# Altium schematic sheet LED_Driver_QBHP686.SchDoc: STB Light Board - 740nm
size A3; Author: mayerph; DrawnBy: mayerph; Organization: PBL; Revision: A; SheetNumber: 2; SheetTotal: 20
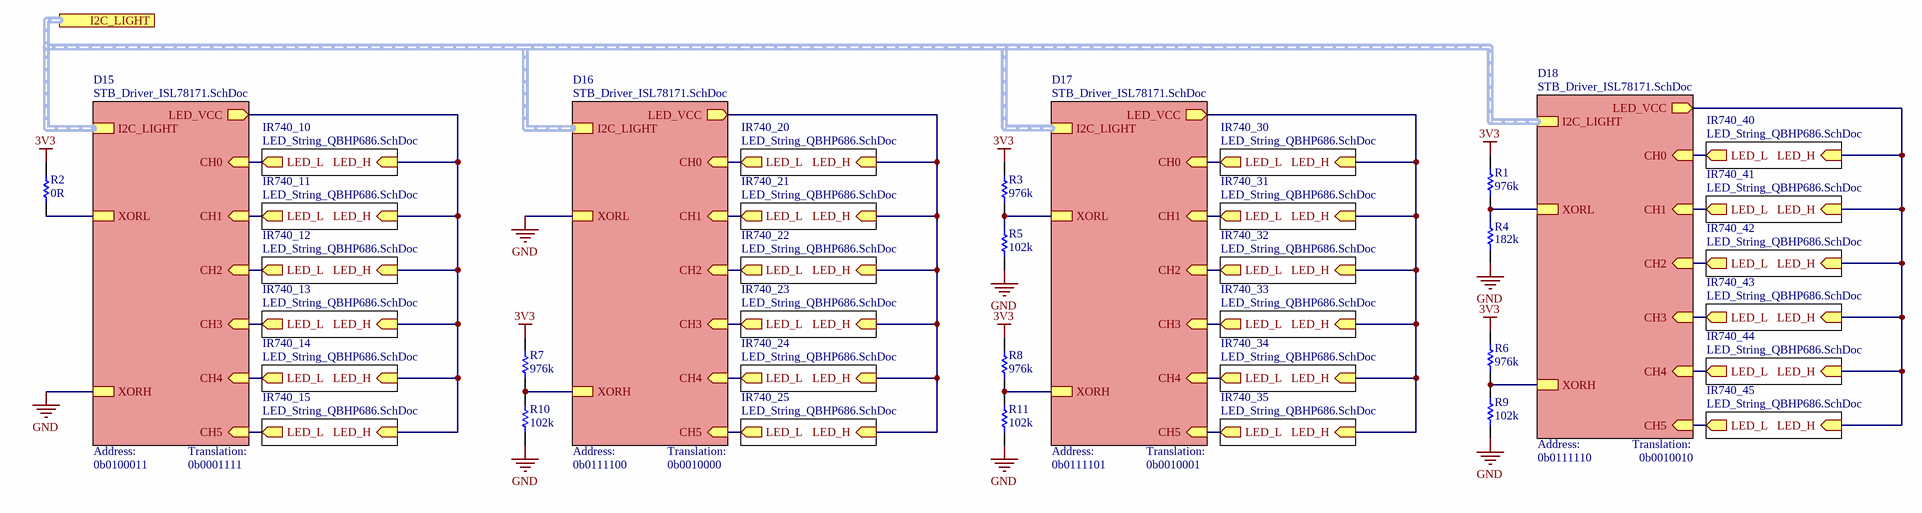
[diagram p0: LED_Driver_QBHP686.SchDoc]

## Parts
R1  976k  [RESC1005X40X25LL05T05]
R2  0R  [RESC1005X40X25LL05T10]
R3  976k  [RESC1005X40X25LL05T05]
R4  182k  [RESC1005X40X25LL05T05]
R5  102k  [RESC1005X40X25LL05T05]
R6  976k  [RESC1005X40X25LL05T05]
R7  976k  [RESC1005X40X25LL05T05]
R8  976k  [RESC1005X40X25LL05T05]
R9  102k  [RESC1005X40X25LL05T05]
R10  102k  [RESC1005X40X25LL05T05]
R11  102k  [RESC1005X40X25LL05T05]

## Sub-sheets
D15 = STB_Driver_ISL78171.SchDoc: CH0 (in), XORL, XORH, LED_VCC (out), CH1 (in), CH2 (in), CH3 (in), CH4 (in), CH5 (in), I2C_LIGHT (harness I2C_LIGHT)
D16 = STB_Driver_ISL78171.SchDoc: CH0 (in), XORL, XORH, LED_VCC (out), CH1 (in), CH2 (in), CH3 (in), CH4 (in), CH5 (in), I2C_LIGHT (harness I2C_LIGHT)
D17 = STB_Driver_ISL78171.SchDoc: CH0 (in), XORL, XORH, LED_VCC (out), CH1 (in), CH2 (in), CH3 (in), CH4 (in), CH5 (in), I2C_LIGHT (harness I2C_LIGHT)
D18 = STB_Driver_ISL78171.SchDoc: CH0 (in), XORL, XORH, LED_VCC (out), CH1 (in), CH2 (in), CH3 (in), CH4 (in), CH5 (in), I2C_LIGHT (harness I2C_LIGHT)
IR740_10 = LED_String_QBHP686.SchDoc: LED_H (in), LED_L (out)
IR740_11 = LED_String_QBHP686.SchDoc: LED_H (in), LED_L (out)
IR740_12 = LED_String_QBHP686.SchDoc: LED_H (in), LED_L (out)
IR740_13 = LED_String_QBHP686.SchDoc: LED_H (in), LED_L (out)
IR740_14 = LED_String_QBHP686.SchDoc: LED_H (in), LED_L (out)
IR740_15 = LED_String_QBHP686.SchDoc: LED_H (in), LED_L (out)
IR740_20 = LED_String_QBHP686.SchDoc: LED_H (in), LED_L (out)
IR740_21 = LED_String_QBHP686.SchDoc: LED_H (in), LED_L (out)
IR740_22 = LED_String_QBHP686.SchDoc: LED_H (in), LED_L (out)
IR740_23 = LED_String_QBHP686.SchDoc: LED_H (in), LED_L (out)
IR740_24 = LED_String_QBHP686.SchDoc: LED_H (in), LED_L (out)
IR740_25 = LED_String_QBHP686.SchDoc: LED_H (in), LED_L (out)
IR740_30 = LED_String_QBHP686.SchDoc: LED_H (in), LED_L (out)
IR740_31 = LED_String_QBHP686.SchDoc: LED_H (in), LED_L (out)
IR740_32 = LED_String_QBHP686.SchDoc: LED_H (in), LED_L (out)
IR740_33 = LED_String_QBHP686.SchDoc: LED_H (in), LED_L (out)
IR740_34 = LED_String_QBHP686.SchDoc: LED_H (in), LED_L (out)
IR740_35 = LED_String_QBHP686.SchDoc: LED_H (in), LED_L (out)
IR740_40 = LED_String_QBHP686.SchDoc: LED_H (in), LED_L (out)
IR740_41 = LED_String_QBHP686.SchDoc: LED_H (in), LED_L (out)
IR740_42 = LED_String_QBHP686.SchDoc: LED_H (in), LED_L (out)
IR740_43 = LED_String_QBHP686.SchDoc: LED_H (in), LED_L (out)
IR740_44 = LED_String_QBHP686.SchDoc: LED_H (in), LED_L (out)
IR740_45 = LED_String_QBHP686.SchDoc: LED_H (in), LED_L (out)

## Ports
I2C_LIGHT (harness I2C_LIGHT, see STB_LightBoard[4C], LED_Driver_AREM-80C0[1A], LED_Driver_AREM-90C0[1A], LED_Driver_NE2B757GT[2B], LED_Driver_NE2G757GT[2B], LED_Driver_NE2R757GT-P6[2B], LED_Driver_NF2L757GT-F1[1A], LED_Driver_NF2W757GT-F1[1A], STB_Driver_ISL78171[1A], STB_FanControl[1A], STB_UID[1A])

## Nets
3V3: R1.2 R2.2 R3.2 R6.2 R7.2 R8.2
GND: R4.1 R5.1 R9.1 R10.1 R11.1 ; sheet D15/XORH, sheet D16/XORL
NetR1_1: R1.1 R4.2 ; sheet D18/XORL
NetR2_1: R2.1 ; sheet D15/XORL
NetR3_1: R3.1 R5.2 ; sheet D17/XORL
NetR6_1: R6.1 R9.2 ; sheet D18/XORH
NetR7_1: R7.1 R10.2 ; sheet D16/XORH
NetR8_1: R8.1 R11.2 ; sheet D17/XORH
(unnamed): sheet D15/CH0, sheet IR740_10/LED_L
(unnamed): sheet D15/LED_VCC, sheet IR740_10/LED_H, sheet IR740_11/LED_H, sheet IR740_12/LED_H, sheet IR740_13/LED_H, sheet IR740_14/LED_H, sheet IR740_15/LED_H
(unnamed): sheet D15/CH1, sheet IR740_11/LED_L
(unnamed): sheet D15/CH2, sheet IR740_12/LED_L
(unnamed): sheet D15/CH3, sheet IR740_13/LED_L
(unnamed): sheet D15/CH4, sheet IR740_14/LED_L
(unnamed): sheet D15/CH5, sheet IR740_15/LED_L
(unnamed): sheet D16/CH0, sheet IR740_20/LED_L
(unnamed): sheet D16/LED_VCC, sheet IR740_20/LED_H, sheet IR740_21/LED_H, sheet IR740_22/LED_H, sheet IR740_23/LED_H, sheet IR740_24/LED_H, sheet IR740_25/LED_H
(unnamed): sheet D16/CH1, sheet IR740_21/LED_L
(unnamed): sheet D16/CH2, sheet IR740_22/LED_L
(unnamed): sheet D16/CH3, sheet IR740_23/LED_L
(unnamed): sheet D16/CH4, sheet IR740_24/LED_L
(unnamed): sheet D16/CH5, sheet IR740_25/LED_L
(unnamed): sheet D17/CH0, sheet IR740_30/LED_L
(unnamed): sheet D17/LED_VCC, sheet IR740_30/LED_H, sheet IR740_31/LED_H, sheet IR740_32/LED_H, sheet IR740_33/LED_H, sheet IR740_34/LED_H, sheet IR740_35/LED_H
(unnamed): sheet D17/CH1, sheet IR740_31/LED_L
(unnamed): sheet D17/CH2, sheet IR740_32/LED_L
(unnamed): sheet D17/CH3, sheet IR740_33/LED_L
(unnamed): sheet D17/CH4, sheet IR740_34/LED_L
(unnamed): sheet D17/CH5, sheet IR740_35/LED_L
(unnamed): sheet D18/CH0, sheet IR740_40/LED_L
(unnamed): sheet D18/LED_VCC, sheet IR740_40/LED_H, sheet IR740_41/LED_H, sheet IR740_42/LED_H, sheet IR740_43/LED_H, sheet IR740_44/LED_H, sheet IR740_45/LED_H
(unnamed): sheet D18/CH1, sheet IR740_41/LED_L
(unnamed): sheet D18/CH2, sheet IR740_42/LED_L
(unnamed): sheet D18/CH3, sheet IR740_43/LED_L
(unnamed): sheet D18/CH4, sheet IR740_44/LED_L
(unnamed): sheet D18/CH5, sheet IR740_45/LED_L

## Buses and harness runs
harness port I2C_LIGHT = sheet D15/I2C_LIGHT = sheet D16/I2C_LIGHT = sheet D17/I2C_LIGHT = sheet D18/I2C_LIGHT

## Notes on the sheet
- 0b0100011
- Address:
- Translation:
- 0b0001111
- (near R10) Address:
- 0b0111100
- 0b0010000
- (near R11) Address:
- 0b0111101
- 0b0010001
- (near R9) Address:
- 0b0111110
- 0b0010010
- 1
- 2
- 3
- 4
- 5
- 6
- 7
- 8
- A
- B
- C
- D
- Project:
- Date:
- Drawing number:
- Rev:
- Format:
- A3
- Drawn by:
- Laboratory:
- Page
- Sheet:
- of
- File:

## Library data of the parts
R1 R3 R6-R8 = CMP-2002-01120-1: Manufacturer: Panasonic; Part Number: ERJ-2RKF9763X; Tolerance: 1%; Rated Power Dissipation (P): 100mW; Rated Temperature: 70°C; Value: 976 kOhm; Temperature Coefficient: 100ppm/°C; Working Voltage: 50V; Package Height: 0.35mm; Package Length: 1mm; Package Width: 0.5mm; Reference Standard: AEC-Q200; Supplier 1: Digi-Key; Supplier Part Number 1: P976KLCT-ND; Manufacturer Part Number: ERJ-2RKF9763X; RoHS: Yes; Category: Chip SMD Resistors; Stock 1: 136638; Pricing 1: 1=0.10000, 10=0.03300, 100=0.01330, 1000=0.00599, 2500=0.00520, 5000=0.00429 (USD); Mount: Surface Mount; Number of Pins: 2; Size Code: 0402; Terminal Finish: Nickel; Package Shape: Rectangular; Min Operating Temperature: -55°C; Max Operating Temperature: 155°C; Resistor Type: FIXED RESISTOR; Construction: Rectangular; Package Style: SMTMeter; Packaging: Tape and Reel; Termination: Wraparound; JESD-609 Code: e3; Technology: METAL GLAZE/THICK FILM; Reach SVHC Compliant: Yes; RoHS Compliant: Yes; ComponentLink1URL: https://datasheet.ciiva.com:443/pdfs/VipMasterIC/IC/PANA/PANA-S-A0009889626/PANA-S-A0009889626-1.pdf?src-supplier=IHS+Markit; ComponentLink1Description: https://datasheet.ciiva.com:443/pdfs/VipMasterIC/IC/PANA/PANA-S-A0009889626/PANA-S-A0009889626-1.pdf?src-supplier=IHS+Markit; ComponentLink2URL: https://datasheet.ciiva.com/43467/1678782-43467581.pdf?src-supplier=Farnell; ComponentLink2Description: https://datasheet.ciiva.com/43467/1678782-43467581.pdf?src-supplier=Farnell; ComponentLink3URL: https://datasheet.ciiva.com/46372/1678782-46372911.pdf?src-supplier=Element14; ComponentLink3Description: https://datasheet.ciiva.com/46372/1678782-46372911.pdf?src-supplier=Element14; ComponentLink4URL: https://datasheet.ciiva.com/22668/1678782-22668415.pdf?src-supplier=Element14; ComponentLink4Description: https://datasheet.ciiva.com/22668/1678782-22668415.pdf?src-supplier=Element14; ComponentLink5URL: https://datasheet.ciiva.com/16758/70260748-16758903.pdf?src-supplier=Allied+Electronics; ComponentLink5Description: https://datasheet.ciiva.com/16758/70260748-16758903.pdf?src-supplier=Allied+Electronics; ComponentLink6URL: https://datasheet.ciiva.com/9179/aoa0000ce2-9179357.pdf?src-supplier=Avnet; ComponentLink6Description: https://datasheet.ciiva.com/9179/aoa0000ce2-9179357.pdf?src-supplier=Avnet; ComponentLink7URL: https://datasheet.ciiva.com/30176/aoa0000ce2-30176831.pdf?src-supplier=Onlinecomponents.com; ComponentLink7Description: https://datasheet.ciiva.com/30176/aoa0000ce2-30176831.pdf?src-supplier=Onlinecomponents.com
R2 = CMP-1011-00001-2: Manufacturer: Yageo / Phycomp; Part Number: RC0402JR-070RL; Rated Power Dissipation (P): 62.5mW; Rated Temperature: 70°C; Package Height: 0.35mm; Package Length: 1mm; Package Width: 0.5mm; Supplier 1: Digi-Key; Supplier Part Number 1: 311-0.0JRDKR-ND; Manufacturer Part Number: RC0402JR-070RL; RoHS: Yes; Category: Chip SMD Resistors; Stock 1: 41330354; Pricing 1: 1=0.10000, 10=0.01200, 25=0.00840, 50=0.00640, 100=0.00480, 250=0.00364, 500=0.00290, 1000=0.00214, 5000=0.00154 (USD); Mount: Surface Mount; Number of Pins: 2; Size Code: 0402; Package Shape: Rectangular; Terminal Finish: Nickel; Min Operating Temperature: -55°C; Max Operating Temperature: 155°C; Resistor Type: FIXED RESISTOR; Resistance: 0R; Packaging: Tape and Reel; Technology: METAL GLAZE/THICK FILM; Termination: Wraparound; JESD-609 Code: e3; Construction: Chip; Package Style: SMTMeter; REACH SVHC: Yes; RoHS Compliant: Yes; ComponentLink1URL: https://datasheet.ciiva.com:443/pdfs/VipMasterIC/IC/YAGO/YAGO-S-A0008145938/YAGO-S-A0008145938-1.pdf?src-supplier=IHS+Markit; ComponentLink1Description: https://datasheet.ciiva.com:443/pdfs/VipMasterIC/IC/YAGO/YAGO-S-A0008145938/YAGO-S-A0008145938-1.pdf?src-supplier=IHS+Markit; ComponentLink2URL: https://datasheet.ciiva.com/2452/pyu-rc0402-51-rohs-l-6-2452608.pdf?src-supplier=Digi-Key; ComponentLink2Description: https://datasheet.ciiva.com/2452/pyu-rc0402-51-rohs-l-6-2452608.pdf?src-supplier=Digi-Key; ComponentLink3URL: https://datasheet.ciiva.com/11808/0900766b80c66297-11808195.pdf?src-supplier=RSComponents; ComponentLink3Description: https://datasheet.ciiva.com/11808/0900766b80c66297-11808195.pdf?src-supplier=RSComponents; ComponentLink4URL: https://datasheet.ciiva.com/7983/1018594-7983535.pdf?src-supplier=Element14; ComponentLink4Description: https://datasheet.ciiva.com/7983/1018594-7983535.pdf?src-supplier=Element14; ComponentLink5URL: https://datasheet.ciiva.com/22747/1018594-22747515.pdf?src-supplier=Element14; ComponentLink5Description: https://datasheet.ciiva.com/22747/1018594-22747515.pdf?src-supplier=Element14; ComponentLink6URL: https://datasheet.ciiva.com/2452/pyu-r-int-thick-7-2452609.pdf?src-supplier=Digi-Key; ComponentLink6Description: https://datasheet.ciiva.com/2452/pyu-r-int-thick-7-2452609.pdf?src-supplier=Digi-Key; ComponentLink7URL: https://datasheet.ciiva.com/2452/pyu-r-int-thick-7-2452610.pdf?src-supplier=Digi-Key; ComponentLink7Description: https://datasheet.ciiva.com/2452/pyu-r-int-thick-7-2452610.pdf?src-supplier=Digi-Key; ComponentLink8URL: https://datasheet.ciiva.com/8896/pyu-rc0402-51-rohs-l-6-8896201.pdf?src-supplier=Avnet; ComponentLink8Description: https://datasheet.ciiva.com/8896/pyu-rc0402-51-rohs-l-6-8896201.pdf?src-supplier=Avnet; ComponentLink9URL: https://datasheet.ciiva.com/15189/getdatasheetpartid-326379-15189533.pdf?src-supplier=Verical; ComponentLink9Description: https://datasheet.ciiva.com/15189/getdatasheetpartid-326379-15189533.pdf?src-supplier=Verical
R4 = CMP-2002-08256-1: Manufacturer: Vishay Dale; Part Number: CRCW0402182KFKED; Value: 182 kOhm; Tolerance: 1%; Rated Power Dissipation (P): 63mW; Resistance: 182kR; Temperature Coefficient: 100ppm/°C; Working Voltage: 50V; Rated Temperature: 70°C; Package Height: 0.35mm; Package Length: 1mm; Package Width: 0.5mm; Reference Standard: AEC-Q200; Supplier 1: Digi-Key; Supplier Part Number 1: 541-182KLDKR-ND; Manufacturer Part Number: CRCW0402182KFKED; RoHS: Yes; Category: Chip SMD Resistors; Stock 1: 76709; Pricing 1: 1=0.10000, 10=0.03600, 100=0.01460, 1000=0.00656, 2500=0.00569, 5000=0.00470 (USD); Mount: Surface Mount; Number of Pins: 2; Size Code: 0402; Terminal Finish: Nickel; Package Shape: Rectangular; Min Operating Temperature: -55°C; Max Operating Temperature: 155°C; JESD-609 Code: e3; Resistor Type: FIXED RESISTOR; Construction: Chip; Package Style: SMTMeter; Packaging: Tape and Reel; Technology: METAL GLAZE/THICK FILM; Termination: Wraparound; Reach SVHC Compliant: Yes; RoHS Compliant: Yes; ComponentLink1URL: https://datasheet.ciiva.com:443/pdfs/VipMasterIC/IC/VISH/VISH-S-A0007266705/VISH-S-A0007266705-1.pdf?src-supplier=IHS+Markit; ComponentLink1Description: https://datasheet.ciiva.com:443/pdfs/VipMasterIC/IC/VISH/VISH-S-A0007266705/VISH-S-A0007266705-1.pdf?src-supplier=IHS+Markit; ComponentLink2URL: https://datasheet.ciiva.com/3256/dcrcwe3-3256117.pdf?src-supplier=Avnet; ComponentLink2Description: https://datasheet.ciiva.com/3256/dcrcwe3-3256117.pdf?src-supplier=Avnet; ComponentLink3URL: https://datasheet.ciiva.com/2463/dcrcwe3-2463286.pdf?src-supplier=Digi-Key; ComponentLink3Description: https://datasheet.ciiva.com/2463/dcrcwe3-2463286.pdf?src-supplier=Digi-Key; ComponentLink4URL: https://datasheet.ciiva.com/5545/dcrcwe3-109170-5545910.pdf?src-supplier=Mouser; ComponentLink4Description: https://datasheet.ciiva.com/5545/dcrcwe3-109170-5545910.pdf?src-supplier=Mouser; ComponentLink5URL: https://datasheet.ciiva.com/2463/dcrcwe3-2463287.pdf?src-supplier=Digi-Key; ComponentLink5Description: https://datasheet.ciiva.com/2463/dcrcwe3-2463287.pdf?src-supplier=Digi-Key; ComponentLink6URL: https://datasheet.ciiva.com/7714/1697337-7714183.pdf?src-supplier=Element14; ComponentLink6Description: https://datasheet.ciiva.com/7714/1697337-7714183.pdf?src-supplier=Element14; ComponentLink7URL: https://datasheet.ciiva.com/2463/dcrcwe3-2463288.pdf?src-supplier=Digi-Key; ComponentLink7Description: https://datasheet.ciiva.com/2463/dcrcwe3-2463288.pdf?src-supplier=Digi-Key; ComponentLink8URL: https://datasheet.ciiva.com/16785/70201119-16785993.pdf?src-supplier=Allied+Electronics; ComponentLink8Description: https://datasheet.ciiva.com/16785/70201119-16785993.pdf?src-supplier=Allied+Electronics; ComponentLink9URL: https://datasheet.ciiva.com/7714/1697337-7714365.pdf?src-supplier=Element14; ComponentLink9Description: https://datasheet.ciiva.com/7714/1697337-7714365.pdf?src-supplier=Element14
R5 R9-R11 = CMP-2002-00613-1: Manufacturer: Panasonic; Part Number: ERJ-2RKF1023X; Tolerance: 1%; Rated Power Dissipation (P): 100mW; Rated Temperature: 70°C; Value: 102 kOhm; Temperature Coefficient: 100ppm/°C; Working Voltage: 50V; Package Height: 0.35mm; Package Length: 1mm; Package Width: 0.5mm; Reference Standard: AEC-Q200; Supplier 1: Digi-Key; Supplier Part Number 1: P102KLDKR-ND; Manufacturer Part Number: ERJ-2RKF1023X; RoHS: Yes; Category: Chip SMD Resistors; Stock 1: 79400; Pricing 1: 1=0.10000, 10=0.03300, 100=0.01330, 1000=0.00599, 2500=0.00520, 5000=0.00429 (USD); Mount: Surface Mount; Number of Pins: 2; Size Code: 0402; Terminal Finish: Nickel; Package Shape: Rectangular; Min Operating Temperature: -55°C; Max Operating Temperature: 155°C; Resistor Type: FIXED RESISTOR; Construction: Rectangular; Package Style: SMTMeter; Packaging: Tape and Reel; Technology: METAL GLAZE/THICK FILM; Termination: Wraparound; JESD-609 Code: e3; Reach SVHC Compliant: Yes; RoHS Compliant: Yes; ComponentLink1URL: https://datasheet.ciiva.com:443/pdfs/VipMasterIC/IC/PANA/PANA-S-A0009889626/PANA-S-A0009889626-1.pdf?src-supplier=IHS+Markit; ComponentLink1Description: https://datasheet.ciiva.com:443/pdfs/VipMasterIC/IC/PANA/PANA-S-A0009889626/PANA-S-A0009889626-1.pdf?src-supplier=IHS+Markit; ComponentLink2URL: https://datasheet.ciiva.com/43467/1678782-43467481.pdf?src-supplier=Farnell; ComponentLink2Description: https://datasheet.ciiva.com/43467/1678782-43467481.pdf?src-supplier=Farnell; ComponentLink3URL: https://datasheet.ciiva.com/9119/aoa0000ce2-9119242.pdf?src-supplier=Avnet; ComponentLink3Description: https://datasheet.ciiva.com/9119/aoa0000ce2-9119242.pdf?src-supplier=Avnet; ComponentLink4URL: https://datasheet.ciiva.com/16781/70260748-16781503.pdf?src-supplier=Allied+Electronics; ComponentLink4Description: https://datasheet.ciiva.com/16781/70260748-16781503.pdf?src-supplier=Allied+Electronics; ComponentLink5URL: https://datasheet.ciiva.com/22673/1678782-22673487.pdf?src-supplier=Element14; ComponentLink5Description: https://datasheet.ciiva.com/22673/1678782-22673487.pdf?src-supplier=Element14; ComponentLink6URL: https://datasheet.ciiva.com/16763/70260748-16763080.pdf?src-supplier=Allied+Electronics; ComponentLink6Description: https://datasheet.ciiva.com/16763/70260748-16763080.pdf?src-supplier=Allied+Electronics; ComponentLink7URL: https://datasheet.ciiva.com/7712/1678782-7712798.pdf?src-supplier=Element14; ComponentLink7Description: https://datasheet.ciiva.com/7712/1678782-7712798.pdf?src-supplier=Element14; ComponentLink8URL: https://datasheet.ciiva.com/46373/1678782-46373215.pdf?src-supplier=Element14; ComponentLink8Description: https://datasheet.ciiva.com/46373/1678782-46373215.pdf?src-supplier=Element14